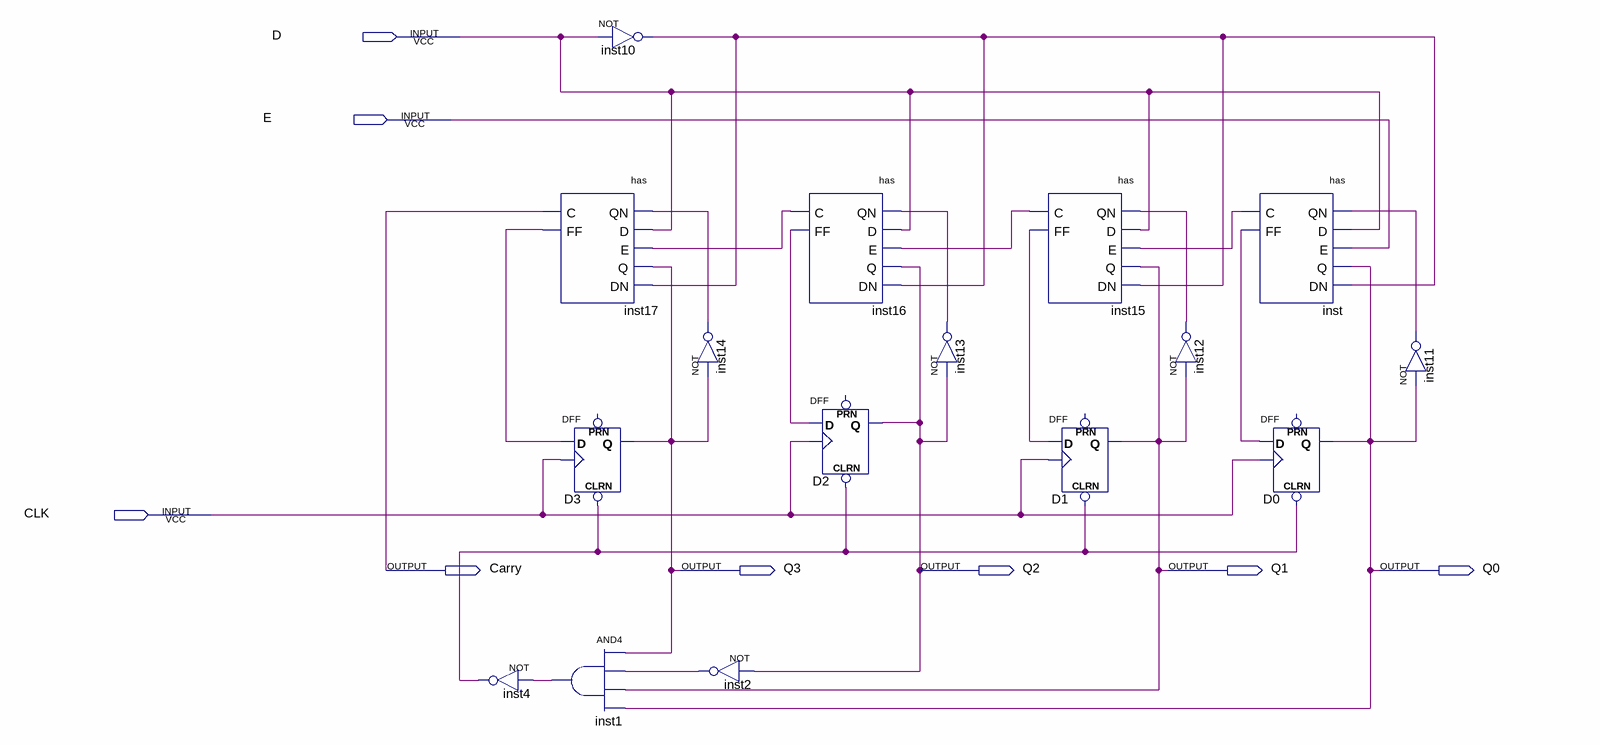
[diagram p0: schematic sheet]
// Quartus schematic Counter.bdf as structural Verilog: 16 symbols, 8 pins
module Counter (
  input  D,
  input  E,
  input  CLK,
  output Carry,
  output Q3,
  output Q2,
  output Q1,
  output Q0
);

  wire inst1_out, inst2_out, inst4_out, inst10_out, inst11_out, inst12_out, inst13_out, inst14_out, inst15_c,
       inst15_ff, inst16_c, inst16_ff, inst17_ff, inst_c, inst_ff;

  not inst4 (inst4_out, inst1_out);
  not inst10 (inst10_out, D);
  has inst17 (.QN(inst14_out), .D(D), .E(inst16_c), .Q(Q3), .DN(inst10_out), .C(Carry), .FF(inst17_ff));
  DFF D3 (.CLRN(inst4_out), .CLK(CLK), .D(inst17_ff), .Q(Q3));  // open: PRN
  and inst1 (inst1_out, Q3, inst2_out, Q1, Q0);
  not inst14 (inst14_out, Q3);
  not inst2 (inst2_out, Q2);
  has inst16 (.QN(inst13_out), .D(D), .E(inst15_c), .Q(Q2), .DN(inst10_out), .C(inst16_c), .FF(inst16_ff));
  DFF D2 (.CLRN(inst4_out), .CLK(CLK), .D(inst16_ff), .Q(Q2));  // open: PRN
  not inst13 (inst13_out, Q2);
  has inst15 (.QN(inst12_out), .D(D), .E(inst_c), .Q(Q1), .DN(inst10_out), .C(inst15_c), .FF(inst15_ff));
  DFF D1 (.CLRN(inst4_out), .CLK(CLK), .D(inst15_ff), .Q(Q1));  // open: PRN
  not inst12 (inst12_out, Q1);
  has inst (.QN(inst11_out), .D(D), .E(E), .Q(Q0), .DN(inst10_out), .C(inst_c), .FF(inst_ff));
  DFF D0 (.CLRN(inst4_out), .CLK(CLK), .D(inst_ff), .Q(Q0));  // open: PRN
  not inst11 (inst11_out, Q0);
endmodule
